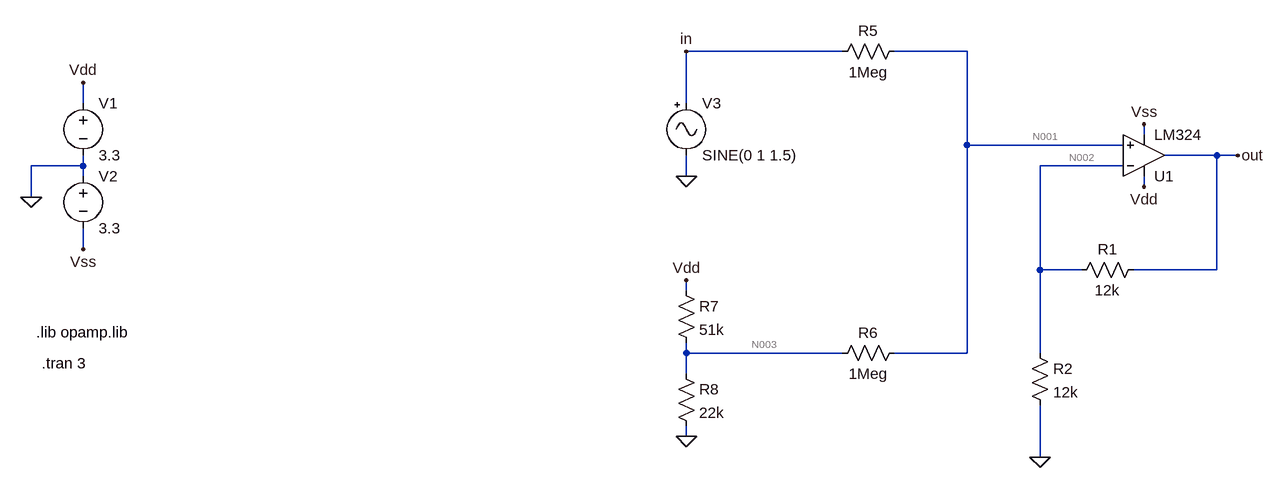
[diagram p0: schematic somador.asc]
somador.asc, the LTspice schematic file:
Version 4
SHEET 1 1464 940
WIRE -96 -416 -336 -416
WIRE 96 -416 -16 -416
WIRE -1264 -336 -1264 -368
WIRE -336 -336 -336 -416
WIRE 368 -288 368 -304
WIRE 96 -272 96 -416
WIRE 336 -272 96 -272
WIRE 480 -256 400 -256
WIRE 512 -256 480 -256
WIRE -1264 -240 -1264 -256
WIRE -1264 -240 -1344 -240
WIRE 336 -240 208 -240
WIRE -1264 -224 -1264 -240
WIRE -336 -224 -336 -256
WIRE 368 -208 368 -224
WIRE -1344 -192 -1344 -240
WIRE -1264 -112 -1264 -144
WIRE 208 -80 208 -240
WIRE 272 -80 208 -80
WIRE 480 -80 480 -256
WIRE 480 -80 352 -80
WIRE -336 -48 -336 -64
WIRE -336 48 -336 32
WIRE -96 48 -336 48
WIRE 96 48 96 -272
WIRE 96 48 -16 48
WIRE 208 48 208 -80
WIRE -336 80 -336 48
WIRE -336 176 -336 160
WIRE 208 208 208 128
FLAG -1344 -192 0
FLAG -1264 -368 Vdd
FLAG 368 -208 Vdd
FLAG 368 -304 Vss
FLAG -1264 -112 Vss
FLAG -336 -224 0
FLAG 512 -256 out
FLAG -336 -416 in
FLAG 208 208 0
FLAG -336 176 0
FLAG -336 -64 Vdd
SYMBOL voltage -1264 -352 R0
SYMATTR InstName V1
SYMATTR Value 3.3
SYMBOL voltage -1264 -240 R0
SYMATTR InstName V2
SYMATTR Value 3.3
SYMBOL res 368 -96 R90
WINDOW 0 0 56 VBottom 2
WINDOW 3 32 56 VTop 2
SYMATTR InstName R1
SYMATTR Value 12k
SYMBOL Opamps\\opamp2 368 -192 M180
SYMATTR InstName U1
SYMATTR Value LM324
SYMBOL res 192 32 R0
SYMATTR InstName R2
SYMATTR Value 12k
SYMBOL res 0 -432 R90
WINDOW 0 0 56 VBottom 2
WINDOW 3 32 56 VTop 2
SYMATTR InstName R5
SYMATTR Value 1Meg
SYMBOL res 0 32 R90
WINDOW 0 0 56 VBottom 2
WINDOW 3 32 56 VTop 2
SYMATTR InstName R6
SYMATTR Value 1Meg
SYMBOL res -352 -64 R0
SYMATTR InstName R7
SYMATTR Value 51k
SYMBOL res -352 64 R0
SYMATTR InstName R8
SYMATTR Value 22k
SYMBOL Misc\\signal -336 -352 R0
SYMATTR InstName V3
SYMATTR Value SINE(0 1 1.5)
TEXT -1336 16 Left 2 !.lib opamp.lib
TEXT -1328 64 Left 2 !.tran 3

The netlist it stands for:
* somador.asc
V1 Vdd 0 3.3
V2 0 Vss 3.3
R1 out N002 12k
XU1 N001 N002 Vdd Vss out LM324  ; pins In+ In- V+ V- OUT
R2 N002 0 12k
R5 N001 in 1Meg
R6 N001 N003 1Meg
R7 Vdd N003 51k
R8 N003 0 22k
V3 in 0 SINE(0 1 1.5)
.lib opamp.lib
.tran 3
.backanno
.end

* Results of the author's LTspice run, read from the files saved beside the schematic
* Operating Point, zero values left out:
*   V(vdd) = 3.3 V
*   V(vss) = -3.3 V
*   V(out) = 1.031 V
*   V(n002) = 515.5 mV
*   V(n001) = 515.9 mV
*   V(n003) = 987.3 mV
*   I(R8) = 44.88 µA
*   I(R7) = 45.35 µA
*   I(R6) = -471.4 nA
*   I(R5) = 515.9 nA
*   I(R2) = 42.96 µA
*   I(R1) = 42.92 µA
*   I(V3) = 515.9 nA
*   I(V2) = -742 µA
*   I(V1) = -830.4 µA
*   Ix(u1:1) = -44.53 nA
*   Ix(u1:2) = -44.94 nA
*   Ix(u1:3) = 785 µA
*   Ix(u1:4) = -742 µA
*   Ix(u1:5) = -42.92 µA
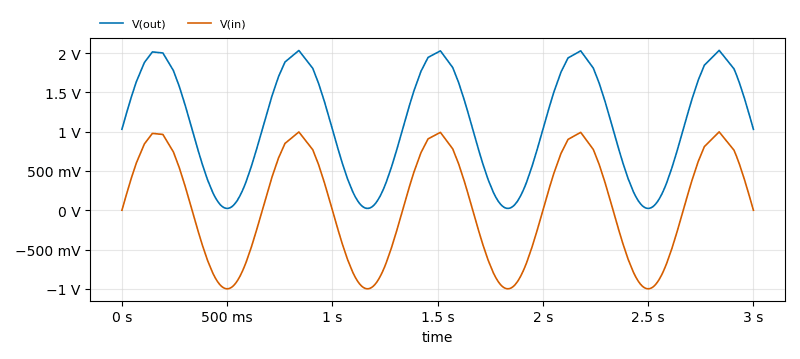
[diagram p1: Transient Analysis of somador.asc, plotted from the saved traces]
* Transient Analysis, 1 run:
*   V(out): min 23.65 mV, max 2.036 V, average 1.096 V, rms 1.302 V, last 1.031 V
*   V(in): min -999.8 mV, max 998 mV, average 64.58 mV, rms 701.5 mV, last 0 V